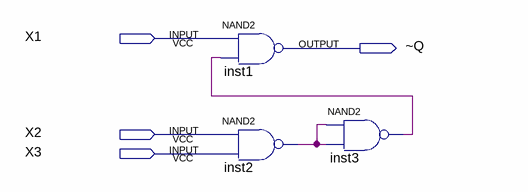
[diagram p0: schematic sheet]
// Quartus schematic NAND3_NAND.bdf as structural Verilog: 3 symbols, 4 pins
module NAND3_NAND (
  input  X1,
  input  X2,
  input  X3,
  output \~Q 
);

  wire inst2_out, inst3_out;

  nand inst1 (\~Q , X1, inst3_out);
  nand inst2 (inst2_out, X2, X3);
  nand inst3 (inst3_out, inst2_out, inst2_out);
endmodule
